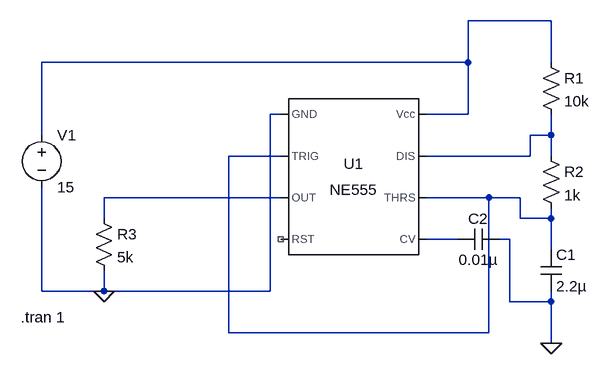
[diagram p0: schematic Square Wave generator with 555 timer..asc]
Square Wave generator with 555 timer..asc, the LTspice schematic file:
Version 4
SHEET 1 880 680
WIRE 672 96 544 96
WIRE 544 160 544 96
WIRE 544 160 -112 160
WIRE 672 160 672 96
WIRE 256 240 240 240
WIRE 544 240 544 160
WIRE 544 240 480 240
WIRE -112 272 -112 160
WIRE 672 272 672 240
WIRE 672 272 640 272
WIRE 256 304 176 304
WIRE 640 304 640 272
WIRE 640 304 480 304
WIRE 672 304 672 272
WIRE 256 368 -16 368
WIRE 576 368 480 368
WIRE 624 368 576 368
WIRE -16 400 -16 368
WIRE 624 400 624 368
WIRE 672 400 672 384
WIRE 672 400 624 400
WIRE 528 432 480 432
WIRE 608 432 592 432
WIRE 672 448 672 400
WIRE -112 512 -112 352
WIRE -16 512 -16 480
WIRE -16 512 -112 512
WIRE 240 512 240 240
WIRE 240 512 -16 512
WIRE 608 528 608 432
WIRE 672 528 672 512
WIRE 672 528 608 528
WIRE 176 576 176 304
WIRE 576 576 576 368
WIRE 576 576 176 576
WIRE 672 592 672 528
FLAG 672 592 0
FLAG -16 512 0
SYMBOL Misc/NE555 368 336 R0
SYMATTR InstName U1
SYMBOL res 656 144 R0
SYMATTR InstName R1
SYMATTR Value 10k
SYMBOL res 656 288 R0
SYMATTR InstName R2
SYMATTR Value 1k
SYMBOL cap 656 448 R0
SYMATTR InstName C1
SYMATTR Value 2.2µ
SYMBOL voltage -112 256 R0
SYMATTR InstName V1
SYMATTR Value 15
SYMBOL res -32 384 R0
SYMATTR InstName R3
SYMATTR Value 5k
SYMBOL cap 592 416 R90
WINDOW 0 0 32 VBottom 2
WINDOW 3 32 32 VTop 2
SYMATTR InstName C2
SYMATTR Value 0.01µ
TEXT -144 552 Left 2 !.tran 1

The netlist it stands for:
* Square Wave generator with 555 timer..asc
XU1 0 N003 N004 NC_01 N005 N003 N002 N001 NE555  ; pins GND TRIG OUT RST CV THRS DIS Vcc
R1 N001 N002 10k
R2 N002 N003 1k
C1 N003 0 2.2µ
V1 N001 0 15
R3 N004 0 5k
C2 0 N005 0.01µ
.tran 1
.lib NE555.sub
.backanno
.end